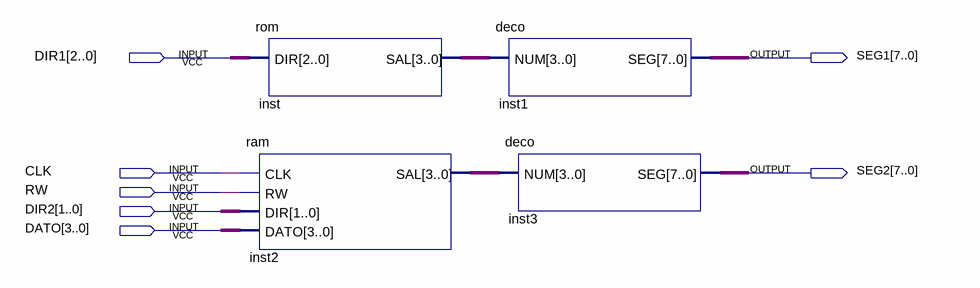
[diagram p0: schematic sheet]
// Quartus schematic practica03.bdf as structural Verilog: 4 symbols, 7 pins
module practica03 (
  input  [2:0] DIR1,
  input  CLK,
  input  RW,
  input  [1:0] DIR2,
  input  [3:0] DATO,
  output [7:0] SEG1,
  output [7:0] SEG2
);

  wire [3:0] inst2_sal, inst_sal;

  rom inst (.DIR(DIR1), .SAL(inst_sal));
  ram inst2 (.CLK(CLK), .RW(RW), .DIR(DIR2), .DATO(DATO), .SAL(inst2_sal));
  deco inst1 (.NUM(inst_sal), .SEG(SEG1));
  deco inst3 (.NUM(inst2_sal), .SEG(SEG2));
endmodule
